# Altium project FD-JUL-MB.PrjPcb (part 2 of 3)

## Sheet Interface.SchDoc
size B; DocumentNumber: 3; SheetNumber: 3; SheetTotal: 7; ENG_APP_DATE: --/--/--; DSN_APP_DATE: --/--/--; CHK_APP_DATE: --/--/--
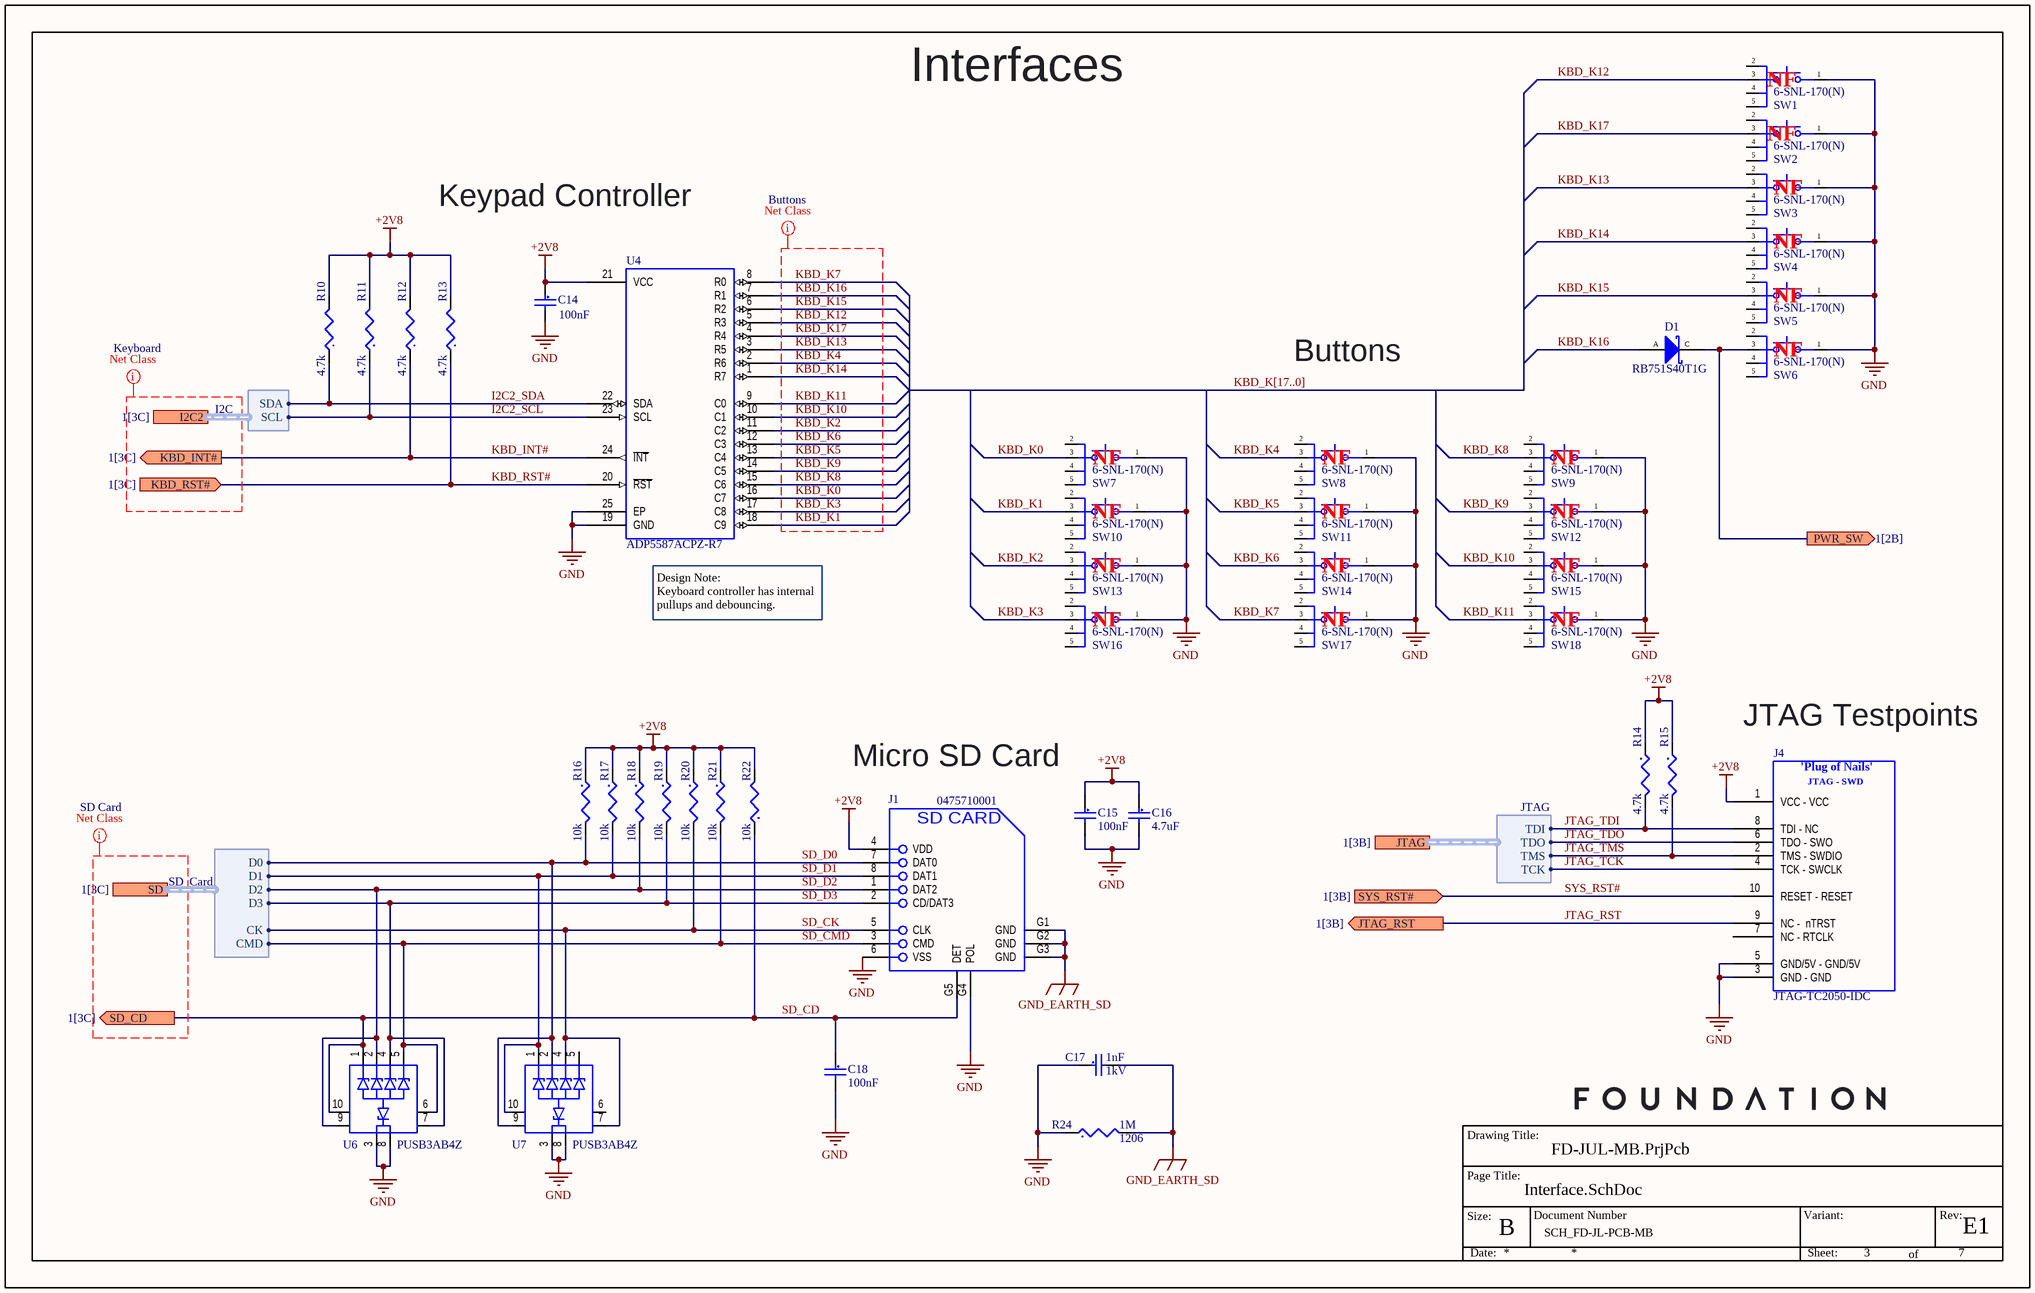
[diagram p3: Interface.SchDoc]

### Parts
C14  Capacitance: 100nF  [CAPC0402(1005)55_L]  (hidden comment: CAP CER 0.1uF 16V 10% X7R 0402)
C15  Capacitance: 100nF  [CAPC0402(1005)55_L]  (hidden comment: CAP CER 0.1uF 16V 10% X7R 0402)
C16  Capacitance: 4.7uF  [CAPC0603(1608)90_L]  (hidden comment: CAP CER 4.7uF 16V 10% X5R 0603)
C17  Capacitance: 1nF  Voltage Rating (DC): 1kV  [CAPC0805(2012)145_N]  (hidden comment: CAP CER 1000pF 1000V 10% X7R 0805)
C18  Capacitance: 100nF  [CAPC0402(1005)55_L]  (hidden comment: CAP CER 0.1uF 16V 10% X7R 0402)
D1  RB751S40T1G  [ON - SOD-523_V]
J1  0475710001  [MOLX - 0475710001_V]
J4  JTAG-TC2050-IDC  [TAGC - TC2050-IDC-FP_V]  (no BOM)
R10  Resistance: 4.7k  [RESC0402(1005)_L]  (hidden comment: RES 4.7K 1/16W 1% 0402)
R11  Resistance: 4.7k  [RESC0402(1005)_L]  (hidden comment: RES 4.7K 1/16W 1% 0402)
R12  Resistance: 4.7k  [RESC0402(1005)_L]  (hidden comment: RES 4.7K 1/16W 1% 0402)
R13  Resistance: 4.7k  [RESC0402(1005)_L]  (hidden comment: RES 4.7K 1/16W 1% 0402)
R14  Resistance: 4.7k  [RESC0402(1005)_L]  (hidden comment: RES 4.7K 1/16W 1% 0402)
R15  Resistance: 4.7k  [RESC0402(1005)_L]  (hidden comment: RES 4.7K 1/16W 1% 0402)
R16  Resistance: 10k  [RESC0402(1005)_L]  (hidden comment: RES 10K 1/16W 1% 0402)
R17  Resistance: 10k  [RESC0402(1005)_L]  (hidden comment: RES 10K 1/16W 1% 0402)
R18  Resistance: 10k  [RESC0402(1005)_L]  (hidden comment: RES 10K 1/16W 1% 0402)
R19  Resistance: 10k  [RESC0402(1005)_L]  (hidden comment: RES 10K 1/16W 1% 0402)
R20  Resistance: 10k  [RESC0402(1005)_L]  (hidden comment: RES 10K 1/16W 1% 0402)
R21  Resistance: 10k  [RESC0402(1005)_L]  (hidden comment: RES 10K 1/16W 1% 0402)
R22  Resistance: 10k  [RESC0402(1005)_L]  (hidden comment: RES 10K 1/16W 1% 0402)
R24  Resistance: 1M  Case Code (Imperial): 1206  [RESC1206(3216)_L]  (hidden comment: RES 1.0M 1/4W 5% 1206)
SW1  6-SNL-170(N)  [TACT - 6-SNL-170_NTP_V]
SW2  6-SNL-170(N)  [TACT - 6-SNL-170_NTP_V]
SW3  6-SNL-170(N)  [TACT - 6-SNL-170_NTP_V]
SW4  6-SNL-170(N)  [TACT - 6-SNL-170_NTP_V]
SW5  6-SNL-170(N)  [TACT - 6-SNL-170_NTP_V]
SW6  6-SNL-170(N)  [TACT - 6-SNL-170_NTP_V]
SW7  6-SNL-170(N)  [TACT - 6-SNL-170_NTP_V]
SW8  6-SNL-170(N)  [TACT - 6-SNL-170_NTP_V]
SW9  6-SNL-170(N)  [TACT - 6-SNL-170_NTP_V]
SW10  6-SNL-170(N)  [TACT - 6-SNL-170_NTP_V]
SW11  6-SNL-170(N)  [TACT - 6-SNL-170_NTP_V]
SW12  6-SNL-170(N)  [TACT - 6-SNL-170_NTP_V]
SW13  6-SNL-170(N)  [TACT - 6-SNL-170_NTP_V]
SW14  6-SNL-170(N)  [TACT - 6-SNL-170_NTP_V]
SW15  6-SNL-170(N)  [TACT - 6-SNL-170_NTP_V]
SW16  6-SNL-170(N)  [TACT - 6-SNL-170_NTP_V]
SW17  6-SNL-170(N)  [TACT - 6-SNL-170_NTP_V]
SW18  6-SNL-170(N)  [TACT - 6-SNL-170_NTP_V]
U4  ADP5587ACPZ-R7  [ADEV - LFCSP-24_L]
U6  PUSB3AB4Z  [NEXP - DFN2510A-10_L]
U7  PUSB3AB4Z  [NEXP - DFN2510A-10_L]

### Ports
I2C2 (harness I2C, see 1[3C]), JTAG (harness JTAG, see 1[3B]), JTAG_RST (out, see 1[3B]), KBD_INT# (out, see 1[3C]), KBD_RST# (in, see 1[3C]), PWR_SW (out, see 1[2B]), SD (harness SD_Card, see 1[3C]), SD_CD (out, see 1[3C]), SYS_RST# (in, see 1[3B])

### Harnesses
SD_Card: CK, CMD, D0, D1, D2, D3
I2C: SCL, SDA
JTAG: TCK, TDI, TDO, TMS

### Nets
+2V8: C14.1 C15.1 C16.1 J1.4(VDD) J4.1(VCC_-_VCC) R10.2 R11.2 R12.2 R13.2 R14.1 R15.1 R16.1 R17.1 R18.1 R19.1 R20.1 R21.1 R22.2 U4.21(VCC)
GND: C14.2 C15.2 C16.2 C17.1 C18.2 J1.6(VSS) J1.G4(POL) J4.3(GND_-_GND) J4.5(GND/5V_-_GND/5V) R24.1 SW1.1 SW2.1 SW3.1 SW4.1 SW5.1 SW6.1 SW7.1 SW8.1 SW9.1 SW10.1 SW11.1 SW12.1 SW13.1 SW14.1 SW15.1 SW16.1 SW17.1 SW18.1 U4.19(GND) U4.25(EP) U6.3(DIODE) U6.8(DIODE) U7.3(DIODE) U7.8(DIODE)
GND_EARTH_SD: C17.2 J1.G1(GND) J1.G2(GND) J1.G3(GND) R24.2
I2C2_SCL: R11.1 U4.23(SCL) ; port I2C2.SCL
I2C2_SDA: R10.1 U4.22(SDA) ; port I2C2.SDA
JTAG_RST: J4.9(NC_-__nTRST) ; port JTAG_RST
JTAG_TCK: J4.4(TCK_-_SWCLK) ; port JTAG.TCK
JTAG_TDI: J4.8(TDI_-_NC) R14.2 ; port JTAG.TDI
JTAG_TDO: J4.6(TDO_-_SWO) ; port JTAG.TDO
JTAG_TMS: J4.2(TMS_-_SWDIO) R15.2 ; port JTAG.TMS
KBD_INT#: R12.1 U4.24(~{INT}) ; port KBD_INT#
KBD_K0: SW7.3 U4.16(C7)
KBD_K1: SW10.3 U4.18(C9)
KBD_K2: SW13.3 U4.11(C2)
KBD_K3: SW16.3 U4.17(C8)
KBD_K4: SW8.3 U4.2(R6)
KBD_K5: SW11.3 U4.13(C4)
KBD_K6: SW14.3 U4.12(C3)
KBD_K7: SW17.3 U4.8(R0)
KBD_K8: SW9.3 U4.15(C6)
KBD_K9: SW12.3 U4.14(C5)
KBD_K10: SW15.3 U4.10(C1)
KBD_K11: SW18.3 U4.9(C0)
KBD_K12: SW1.3 U4.5(R3)
KBD_K13: SW3.3 U4.3(R5)
KBD_K14: SW4.3 U4.1(R7)
KBD_K15: SW5.3 U4.6(R2)
KBD_K16: D1.A U4.7(R1)
KBD_K17: SW2.3 U4.4(R4)
KBD_RST#: R13.1 U4.20(~{RST}) ; port KBD_RST#
PWR_SW: D1.C SW6.3 ; port PWR_SW
SD_CD: C18.1 J1.G5(DET) R22.1 U6.1(DIODE) U6.10(DIODE) ; port SD_CD
SD_CK: J1.5(CLK) R20.2 U7.4(DIODE) U7.7(DIODE) ; port SD.CK
SD_CMD: J1.3(CMD) R21.2 U6.5(DIODE) U6.6(DIODE) ; port SD.CMD
SD_D0: J1.7(DAT0) R16.2 U7.2(A) U7.9(DIODE) ; port SD.D0
SD_D1: J1.8(DAT1) R17.2 U7.1(DIODE) U7.10(DIODE) ; port SD.D1
SD_D2: J1.1(DAT2) R18.2 U6.2(A) U6.9(DIODE) ; port SD.D2
SD_D3: J1.2(CD/DAT3) R19.2 U6.4(DIODE) U6.7(DIODE) ; port SD.D3
SYS_RST#: J4.10(RESET_-_RESET) ; port SYS_RST#

Not connected (* = marked no-connect by the designer): J4 7(NC_-_RTCLK); SW1 2 4 5; SW2 2 4 5; SW3 2 4 5; SW4 2 4 5; SW5 2 4 5; SW6 2 4 5; SW7 2 4 5; SW8 2 4 5; SW9 2 4 5; SW10 2 4 5; SW11 2 4 5; SW12 2 4 5; SW13 2 4 5; SW14 2 4 5; SW15 2 4 5; SW16 2 4 5; SW17 2 4 5; SW18 2 4 5; U7 5(DIODE) 6(DIODE)

### Buses and harness runs
bus KBD_K[17..0]

### Layout directives
net class Keyboard: (no net found under the mark)
net class SD Card: (no net found under the mark)
net class Buttons: KBD_K0, KBD_K1, KBD_K2, KBD_K3, KBD_K4, KBD_K5, KBD_K6, KBD_K7, KBD_K8, KBD_K9, KBD_K10, KBD_K11, KBD_K12, KBD_K13, KBD_K14, KBD_K15, KBD_K16, KBD_K17

### Notes on the sheet
- Interfaces
- Keypad Controller
- Buttons
- (near U4) Design Note:
  Keyboard controller has internal pullups and debouncing.
- (near C15) Micro SD Card
- JTAG Testpoints
- Drawing Title:
- Page Title:
- Size:
- B
- Document Number
- Variant:
- Rev:
- Date:
- Sheet:
- of
- (in symbol CMP-CON-0006-11) 'Plug of Nails'; JTAG - SWD
- (in symbol CMP-CON-0008-2) SD CARD

### Library data of the parts
C14 C15 C18 = CMP-CAP-00002-2: 0.1µF ±10% 16V Ceramic Capacitor X7R 0402 (1005 Metric); Insulation Resistance: 10GR; Material: Ceramic; Tolerance: 10%; REACH SVHC: No SVHC; Radiation Hardening: No; Case Code (Metric): 1005; Height: 0.5mm; Depth: 0.5mm; Min Operating Temperature: -55°C; Max Operating Temperature: 125°C; Lead Free: Lead Free; Thickness: 0.022inch; Length: 1mm; Voltage Rating (DC): 16V; Dielectric Material: Ceramic; Packaging: Tape and Reel; Case/Package: 0402; Width: 0.5mm; Termination: SMD/SMT; Voltage Rating: 16V; Mount: Surface Mount; Case Code (Imperial): 0402; Package Quantity: 1; Dielectric: X7R; Number of Pins: 2; Voltage: 16V
C16 = CMP-CAP-00003-1: 4.7µF ±10% 16V Ceramic Capacitor X5R 0603 (1608 Metric); Length: 1.6mm; Termination: SMD/SMT; Max Operating Temperature: 85°C; Case Code (Imperial): 0603; Height: 0.8mm; Voltage Rating: 16V; Composition: Ceramic; Dielectric: X5R; Voltage Rating (DC): 16V; REACH SVHC: No SVHC; Case Code (Metric): 1608; Tolerance: 10%; Case/Package: 0603; Min Operating Temperature: -55°C; Width: 0.8mm; Mount: Surface Mount; Packaging: Tape and Reel; Package Quantity: 1; Thickness: 0.035inch; Number of Pins: 2
C17 = CMP-CAP-00004-1: 1000pF ±10% 1000V (1kV) Ceramic Capacitor X7R 0805 (2012 Metric); Insulation Resistance: 100GR; Mount: Surface Mount; Width: 1.25mm; Voltage Rating: 1kV; Number of Pins: 2; Packaging: Tape and Reel; Package Quantity: 4000; Termination: SMD/SMT; Height: 1.3mm; Case Code (Metric): 2012; Depth: 1.25mm; Dielectric: X7R; Thickness: 0.051inch; Length: 2.01mm; Case Code (Imperial): 0805; Contact Plating: Nickel,Tin,Matte; Dissipation Factor: 10%; Tolerance: 10%; Case/Package: 0805; Min Operating Temperature: -55°C; REACH SVHC: No SVHC; Lead Free: Lead Free; Dielectric Material: Ceramic; Max Operating Temperature: 125°C
D1 = CMP-DIO-0007-1: Diode Schottky 30V 30mA (DC) Surface Mount SOD-523; Voltage Rating (DC): 40V; Peak Non-Repetitive Surge Current: 500mA; Peak Reverse Current: 500nA; Element Configuration: Single; Capacitance: 2.5pF; Power Dissipation: 200mW; Polarity: Standard; Forward Voltage: 370mV; Radiation Hardening: No; Min Operating Temperature: -55°C; Current Rating: 30mA; Forward Current: 30mA; Number of Pins: 2; Average Rectified Current: 30mA; Output Current: 30mA; Max Operating Temperature: 150°C; Width: 0.9mm; ComponentLink1Description: Datasheet; Length: 1.3mm; Max Surge Current: 500mA; Max Reverse Voltage (DC): 30V; REACH SVHC: No SVHC; Lead Free: Lead Free; Max Reverse Leakage Current: 500nA; Max Forward Surge Current (Ifsm): 500mA; Package Quantity: 1; ComponentLink1URL: https://www.onsemi.cn/PowerSolutions/document/RB751S40T1-D.PDF; Max Repetitive Reverse Voltage (Vrrm): 40V; Contact Plating: Tin,Matte; Case/Package: SOD-523-2; Height: 0.7mm; Packaging: Tape and Reel
J1 = CMP-CON-0008-2: CONN MICRO SD CARD PUSH-PULL R/A; Connector Type: Connector; Number of Contacts: 8; Pitch: 1.1mm; ComponentLink1Description: Drawing; Packaging: Tape and Reel; ComponentLink3Description: Spec; Depth: 5.45mm; Max Operating Temperature: 85°C; Termination: Solder; Housing Material: Polymer; ComponentLink2Description: Electrical Model; Contact Material: Bronze; ComponentLink1URL: https://www.molex.com/pdm_docs/sd/475710001_sd.pdf; Orientation: Right Angle; Min Operating Temperature: -40°C; Mount: Surface Mount; ComponentLink3URL: https://www.molex.com/pdm_docs/ps/PS-47309-001.pdf; ComponentLink2URL: https://media.digikey.com/pdf/Data%20Sheets/Molex%20PDFs/0475710001_Elect_Model.pdf; Contact Plating: Gold; Package Quantity: 1500; Length: 11.4mm; Number of Rows: 1
J4 = CMP-CON-0006-11: PLUG-OF-NAILS 10-PIN W/LEGS; ComponentLink3Description: Cable; ComponentLink2Description: Adapter; ComponentLink1Description: Datasheet; ComponentLink2URL: https://www.tag-connect.com/wp-content/uploads/bsk-pdf-manager/TC2050-ARM2010_18.pdf; ComponentLink3URL: https://www.digikey.com/product-detail/en/tag-connect-llc/TC2050-IDC/TC2050-IDC-ND/2605366; Case/Package: Custom; ComponentLink1URL: https://www.tag-connect.com/wp-content/uploads/bsk-pdf-manager/TC2050-IDC_Datasheet_7.pdf
R10-R15 = CMP-RES-00002-3: 4.7 kOhms ±1% 0.063W, 1/16W Chip Resistor 0402 (1005 Metric) Automotive AEC-Q200 Thick Film; Max Power Dissipation: 63mW; Voltage Rating (DC): 50V; Temperature Coefficient: 100ppm/°C; Weight: 2.3E-05oz; Package Quantity: 10; Military Standard: Not; Contact Plating: Tin; Termination: SMD/SMT; Max Operating Temperature: 155°C; Case Code (Metric): 1005; Case Code (Imperial): 0402; Features: Automotive AEC-Q200; Power Rating: 63mW; REACH SVHC: Unknown; Min Operating Temperature: -55°C; Tolerance: 1%; Mount: Surface Mount; Width: 0.5mm; Depth: 0.5mm; Radiation Hardening: No; Length: 1mm; Number of Terminations: 2; Case/Package: 0402; Voltage Rating: 50V; Height: 0.35mm; Packaging: Tape and Reel; Lead Free: Lead Free; Composition: Thick Film
R16-R21 = CMP-RES-00006-3: 10 kOhms ±1% 0.063W, 1/16W Chip Resistor 0402 (1005 Metric); Voltage Rating (DC): 50V; Power Rating: 63mW; Temperature Coefficient: 100ppm/°C; Case Code (Imperial): 0402; Mount: Surface Mount; Composition: Thick Film; Features: Automotive AEC-Q200; Depth: 0.5mm; Height: 0.35mm; Weight: 2.3E-05oz; Number of Pins: 2; Termination: SMD/SMT; Min Operating Temperature: -55°C; Length: 1mm; Package Quantity: 10; Lead Free: Lead Free; Radiation Hardening: No; Max Operating Temperature: 155°C; Voltage Rating: 50V; Military Standard: Not; Case/Package: 0402; Contact Plating: Tin; Max Power Dissipation: 63mW; Tolerance: 1%; Case Code (Metric): 1005; Number of Terminations: 2; Packaging: Tape and Reel; REACH SVHC: Unknown; Width: 0.02inch
R22 = CMP-RES-00006-3: 10 kOhms ±1% 0.063W, 1/16W Chip Resistor 0402 (1005 Metric); Max Power Dissipation: 63mW; Voltage Rating (DC): 50V; Temperature Coefficient: 100ppm/°C; Width: 0.02inch; Power Rating: 63mW; Case/Package: 0402; Min Operating Temperature: -55°C; Number of Terminations: 2; Lead Free: Lead Free; Features: Automotive AEC-Q200; Number of Pins: 2; Tolerance: 1%; Height: 0.35mm; Mount: Surface Mount; Radiation Hardening: No; Length: 1mm; Case Code (Metric): 1005; Weight: 2.3E-05oz; Military Standard: Not; Depth: 0.5mm; Package Quantity: 10; Max Operating Temperature: 155°C; Termination: SMD/SMT; Case Code (Imperial): 0402; Contact Plating: Tin; Voltage Rating: 50V; Composition: Thick Film; Packaging: Tape and Reel; REACH SVHC: Unknown
R24 = CMP-RES-00004-3: 1 MOhms ±5% 0.25W, 1/4W Chip Resistor 1206 (3216 Metric) Moisture Resistant Thick Film; Power Rating: 250mW; Temperature Coefficient: 200ppm/°C; Voltage Rating: 200V; Mount: Surface Mount; Radiation Hardening: No; Tolerance: 5%; Military Standard: Not; Termination: SMD/SMT; Case Code (Metric): 3216; Depth: 1.6mm; Case/Package: 1206; REACH SVHC: No SVHC; Height: 0.6mm; Max Operating Temperature: 155°C; Package Quantity: 5000; Thickness: 610um; Min Operating Temperature: -55°C; Voltage Rating (DC): 200V; Length: 3.2mm; Composition: Thick Film; Width: 1.6mm; Packaging: Tape and Reel; Contact Plating: Tin
SW1-SW18 = CMP-SWH-00000-9: Tactile Components. 6mm star dome tactile switch.
U4 = CMP-IC-INT-0000-10: I/O Expander 18 I²C 400kHz 24-LFCSP-WQ (4x4); Max Supply Voltage: 3.6V; Number of I/Os: 18; Nominal Supply Current: 200uA; Min Supply Voltage: 1.65V; Interface: I2C; Number of Pins: 24; REACH SVHC: No SVHC; Case/Package: 24-LFCSP-WQ (4x4); Max Operating Temperature: 85°C; Package Quantity: 1500; Min Operating Temperature: -40°C; Frequency: 400kHz; Packaging: Tape and Reel; Mount: Surface Mount; Lead Free: Contains Lead; Max Frequency: 400kHz; ComponentLink1URL: https://www.analog.com/media/en/technical-documentation/data-sheets/ADP5587.pdf; ComponentLink1Description: Datasheet; Max Supply Current: 200uA
U6 U7 = CMP-DIO-0006-4: TVS DIODE 3.3V 5V DFN2510A-10; Capacitance @ Frequency: 0.17pF @ 1MHz; Bidirectional Channels: 4; Type: Zener; Max Operating Temperature: 85°C; Min Operating Temperature: -40°C; Case/Package: DFN2510A-10; ComponentLink1Description: Datasheet; ComponentLink1URL: https://assets.nexperia.com/documents/data-sheet/PUSB3AB4.pdf

## Sheet Power.SchDoc
size B; DocumentNumber: 6; SheetNumber: 6; SheetTotal: 7; ENG_APP_DATE: --/--/--; DSN_APP_DATE: --/--/--; CHK_APP_DATE: --/--/--
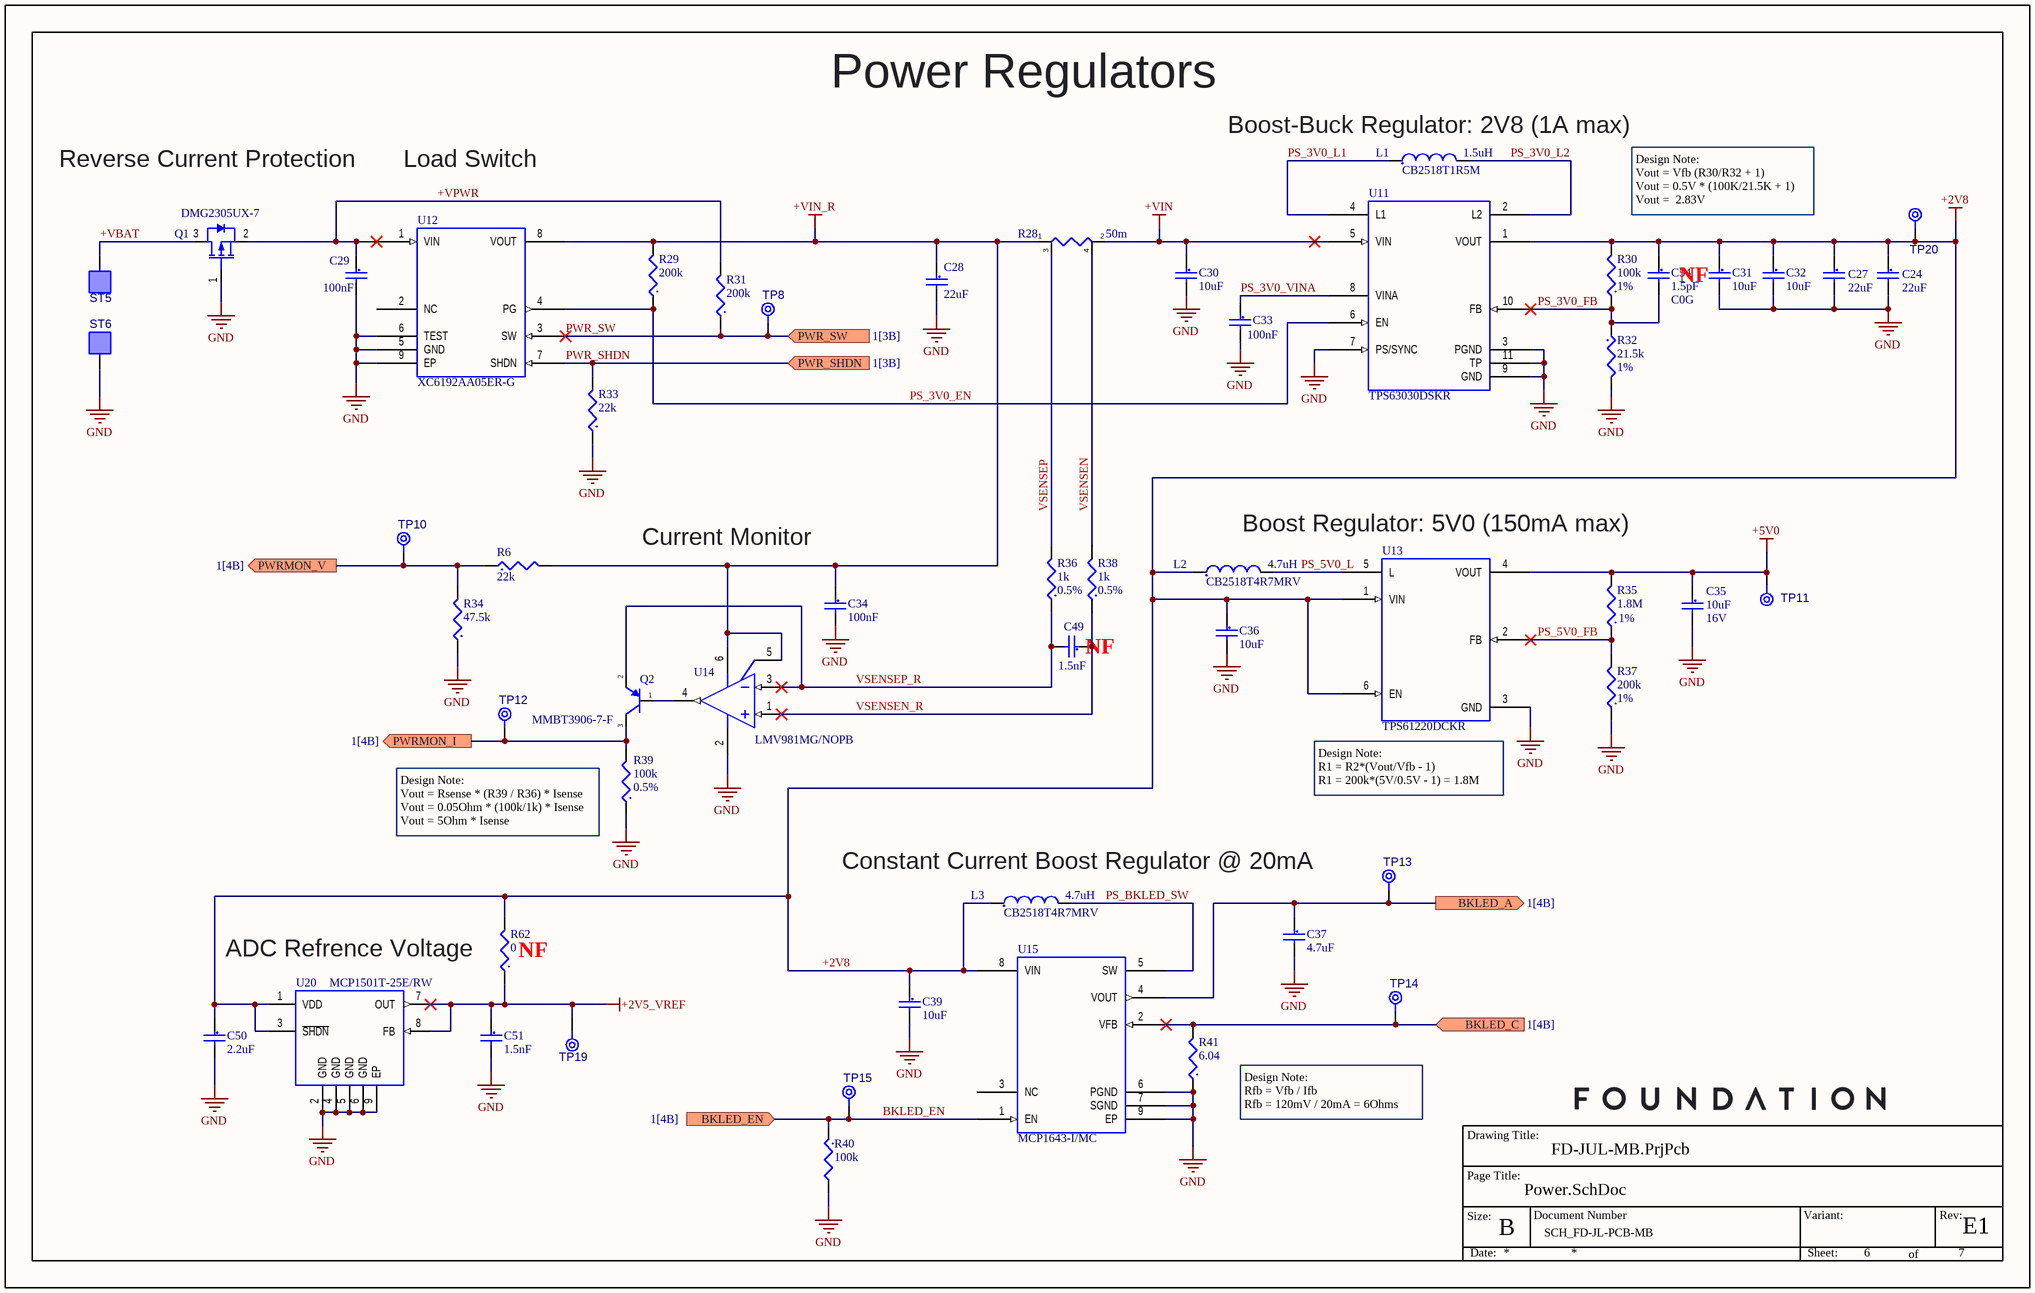
[diagram p4: Power.SchDoc]

### Parts
C24  Capacitance: 22uF  [CAPC0805(2012)145_L]  (hidden comment: CAP CER 22uF 16V 10% X5R 0805)
C27  Capacitance: 22uF  [CAPC0805(2012)145_L]  (hidden comment: CAP CER 22uF 16V 10% X5R 0805)
C28  Capacitance: 22uF  [CAPC0805(2012)145_L]  (hidden comment: CAP CER 22uF 16V 10% X5R 0805)
C29  Capacitance: 100nF  [CAPC0402(1005)55_L]  (hidden comment: CAP CER 0.1uF 16V 10% X7R 0402)
C30  Capacitance: 10uF  [CAPC0603(1608)90_L]  (hidden comment: CAP CER 10uF 6.3V 20% X5R 0603)
C31  Capacitance: 10uF  [CAPC0603(1608)90_L]  (hidden comment: CAP CER 10uF 6.3V 20% X5R 0603)
C32  Capacitance: 10uF  [CAPC0603(1608)90_L]  (hidden comment: CAP CER 10uF 6.3V 20% X5R 0603)
C33  Capacitance: 100nF  [CAPC0402(1005)55_L]  (hidden comment: CAP CER 0.1uF 16V 10% X7R 0402)
C34  Capacitance: 100nF  [CAPC0402(1005)55_L]  (hidden comment: CAP CER 0.1uF 16V 10% X7R 0402)
C35  Capacitance: 10uF  Voltage Rating (DC): 16V  [CAPC0603(1608)90_L]  (hidden comment: CAP CER 10uF 16V 20% X5R 0603)
C36  Capacitance: 10uF  [CAPC0603(1608)90_L]  (hidden comment: CAP CER 10uF 6.3V 20% X5R 0603)
C37  Capacitance: 4.7uF  [CAPC0603(1608)90_L]  (hidden comment: CAP CER 4.7uF 16V 10% X5R 0603)
C39  Capacitance: 10uF  [CAPC0603(1608)90_L]  (hidden comment: CAP CER 10uF 6.3V 20% X5R 0603)
C49  Capacitance: 1.5nF  [CAPC0402(1005)55_L]  (hidden comment: CAP CER 1500pF 50V 10% X7R 0402)
C50  Capacitance: 2.2uF  [CAPC0402(1005)55_L]  (hidden comment: CAP CER 2.2uF 6.3V 10% X5R 0402)
C51  Capacitance: 1.5nF  [CAPC0402(1005)55_L]  (hidden comment: CAP CER 1500pF 50V 10% X7R 0402)
C54  Capacitance: 1.5pF  Dielectric: C0G  [CAPC0402(1005)55_L]  (hidden comment: CAP CER 1.5pF 50V C0G 0402)
L1  CB2518T1R5M  Inductance: 1.5uH  [INDC1007(2518)_L]
L2  CB2518T4R7MRV  Inductance: 4.7uH  [INDC1007(2518)_L]
L3  CB2518T4R7MRV  Inductance: 4.7uH  [INDC1007(2518)_L]
Q1  DMG2305UX-7  [DIOD-SOT23-3_A_V]
Q2  MMBT3906-7-F  [DIOD-SOT23-3_A_V]
R6  Resistance: 22k  [RESC0402(1005)_L]  (hidden comment: RES 22K 1/16W 1% 0402)
R28  Resistance: 50m  [RESC4T1206(3216)_V]  (hidden comment: RES4T 0.05 OHM 0.5% 1/2W 1206)
R29  Resistance: 200k  [RESC0402(1005)_L]  (hidden comment: RES 200K 1/16W 1% 0402)
R30  Resistance: 100k  Tolerance: 1%  [RESC0402(1005)_L]  (hidden comment: RES 100K 1/16W 1% 0402)
R31  Resistance: 200k  [RESC0402(1005)_L]  (hidden comment: RES 200K 1/16W 1% 0402)
R32  Resistance: 21.5k  Tolerance: 1%  [RESC0402(1005)_L]  (hidden comment: RES 21.5K 1/16W 1% 0402)
R33  Resistance: 22k  [RESC0402(1005)_L]  (hidden comment: RES 22K 1/16W 1% 0402)
R34  Resistance: 47.5k  [RESC0402(1005)_L]  (hidden comment: RES 47.5K 1/16W 1% 0402)
R35  Resistance: 1.8M  Tolerance: 1%  [RESC0402(1005)_L]  (hidden comment: RES 1.8M 1/16W 1% 0402)
R36  Resistance: 1k  Tolerance: 0.5%  [RESC0402(1005)_L]  (hidden comment: RES 1.0K 1/16W 1% 0402)
R37  Resistance: 200k  Tolerance: 1%  [RESC0402(1005)_L]  (hidden comment: RES 200K 1/16W 1% 0402)
R38  Resistance: 1k  Tolerance: 0.5%  [RESC0402(1005)_L]  (hidden comment: RES 1.0K 1/16W 1% 0402)
R39  Resistance: 100k  Tolerance: 0.5%  [RESC0402(1005)_L]  (hidden comment: RES 100K 1/16W 0.5% 0402)
R40  Resistance: 100k  [RESC0402(1005)_L]  (hidden comment: RES 100K 1/16W 1% 0402)
R41  Resistance: 6.04  [RESC0402(1005)_L]  (hidden comment: RES 6.04 OHM 1/16W 1% 0402)
R62  Resistance: 0  [RESC0402(1005)_L]  (hidden comment: RES 0 OHM JUMPER 1/16W 0402)
ST5  PAD-2_54X2_54Y  [PAD-2_54X2_54Y]  (value not drawn)  (no BOM)
ST6  PAD-2_54X2_54Y  [PAD-2_54X2_54Y]  (value not drawn)  (no BOM)
TP8  TPAD8R  [TP08R]  (value not drawn)  (no BOM)
TP10  TPAD8R  [TP08R]  (value not drawn)  (no BOM)
TP11  TPAD8R  [TP08R]  (value not drawn)  (no BOM)
TP12  TPAD8R  [TP08R]  (value not drawn)  (no BOM)
TP13  TPAD8R  [TP08R]  (value not drawn)  (no BOM)
TP14  TPAD8R  [TP08R]  (value not drawn)  (no BOM)
TP15  TPAD8R  [TP08R]  (value not drawn)  (no BOM)
TP19  TPAD8R  [TP08R]  (value not drawn)  (no BOM)
TP20  TPAD8R  [TP08R]  (value not drawn)  (no BOM)
U11  TPS63030DSKR  [TI - VSON-10_L]
U12  XC6192AA05ER-G  [TORX - USP-8B06_V]
U13  TPS61220DCKR  [TI - SC70-6_L]
U14  LMV981MG/NOPB  [TI - SC70-6_L]
U15  MCP1643-I/MC  [MCHP - DFN-8_L]
U20  MCP1501T-25E/RW  [MCHP - WDFN-8_L]

### Ports
BKLED_A (out, see 1[4B]), BKLED_C (in, see 1[4B]), BKLED_EN (in, see 1[4B]), PWR_SHDN (in, see 1[3B]), PWR_SW (in, see 1[3B]), PWRMON_I (out, see 1[4B]), PWRMON_V (out, see 1[4B])

### Nets
+2V5_VREF: C51.1 R62.1 TP19.1(TP) U20.7(OUT) U20.8(FB)
+2V8: C24.1 C27.1 C31.1 C32.1 C36.1 C39.1 C50.1 C54.1 L2.1 L3.1 R30.2 R62.2 TP20.1(TP) U11.1(VOUT) U13.1(VIN) U13.6(EN) U15.8(VIN) U20.1(VDD) U20.3(~{SHDN})
+5V0: C35.1 R35.2 TP11.1(TP) U13.4(VOUT)
+VIN: C30.1 R28.2(I2) U11.5(VIN)
+VIN_R: C28.1 C34.1 R6.2 R28.1(I1) R29.2 U12.8(VOUT) U14.5(~{SHDN}) U14.6(VDD)
GND: C24.2 C27.2 C28.2 C29.2 C30.2 C31.2 C32.2 C33.2 C34.2 C35.2 C36.2 C37.2 C39.2 C50.2 C51.2 Q1.1(GATE) R32.2 R33.1 R34.1 R37.1 R39.1 R40.2 R41.1 ST6.1 U11.3(PGND) U11.7(PS/SYNC) U11.9(GND) U11.11(TP) U12.5(GND) U12.6(TEST) U12.9(EP) U13.3(GND) U14.2(GND) U15.6(PGND) U15.7(SGND) U15.9(EP) U20.2(GND) U20.4(GND) U20.5(GND) U20.6(GND) U20.9(EP)
+VBAT: Q1.3(DRAIN) ST5.1
+VPWR: C29.1 Q1.2(SOURCE) R31.2 U12.1(VIN)
BKLED_A: C37.1 TP13.1(TP) U15.4(VOUT) ; port BKLED_A
BKLED_C: R41.2 TP14.1(TP) U15.2(VFB) ; port BKLED_C
BKLED_EN: R40.1 TP15.1(TP) U15.1(EN) ; port BKLED_EN
PS_3V0_EN: R29.1 U11.6(EN) U12.4(PG)
PS_3V0_FB: C54.2 R30.1 R32.1 U11.10(FB)
PS_3V0_L1: L1.1 U11.4(L1)
PS_3V0_L2: L1.2 U11.2(L2)
PS_3V0_VINA: C33.1 U11.8(VINA)
PS_5V0_FB: R35.1 R37.2 U13.2(FB)
PS_5V0_L: L2.2 U13.5(L)
PS_BKLED_SW: L3.2 U15.5(SW)
PWR_SHDN: R33.2 U12.7(SHDN) ; port PWR_SHDN
PWR_SW: R31.1 TP8.1(TP) U12.3(SW) ; port PWR_SW
PWRMON_I: Q2.3(C) R39.2 TP12.1(TP) ; port PWRMON_I
PWRMON_V: R6.1 R34.2 TP10.1(TP) ; port PWRMON_V
VSENSEN: R28.4(E2) R38.2
VSENSEN_R: C49.1 R38.1 U14.1(IN+)
VSENSEP: R28.3(E1) R36.2
VSENSEP_R: C49.2 Q2.2(E) R36.1 U14.3(IN-)
NetQ2_1: Q2.1(B) U14.4(OUT)

Not connected (* = marked no-connect by the designer): U12 2(NC); U15 3(NC)

### Notes on the sheet
- Power Regulators
- (near L1) Boost-Buck Regulator: 2V8 (1A max)
- Reverse Current Protection
- Load Switch
- Design Note:
  Vout = Vfb (R30/R32 + 1)
  Vout = 0.5V * (100K/21.5K + 1)
  Vout =  2.83V
- (near C34) Current Monitor
- Boost Regulator: 5V0 (150mA max)
- Design Note:
  Vout = Rsense * (R39 / R36) * Isense
  Vout = 0.05Ohm * (100k/1k) * Isense
  Vout = 5Ohm * Isense
- (near U13) Design Note:
  R1 = R2*(Vout/Vfb - 1)
  R1 = 200k*(5V/0.5V - 1) = 1.8M
- (near L3) Constant Current Boost Regulator @ 20mA
- ADC Refrence Voltage
- Design Note:
  Rfb = Vfb / Ifb
  Rfb = 120mV / 20mA = 6Ohms
- Drawing Title:
- Page Title:
- Size:
- B
- Document Number
- Variant:
- Rev:
- Date:
- Sheet:
- of

### Library data of the parts
C24 C27 C28 = CMP-CAP-00010-2: 22µF ±10% 16V Ceramic Capacitor X5R 0805 (2012 Metric); Packaging: Tape and Reel; Length: 2mm; Max Operating Temperature: 85°C; REACH SVHC: No SVHC; Lead Free: Lead Free; Termination: SMD/SMT; Width: 0.049inch; Thickness: 0.057inch; Min Operating Temperature: -55°C; Height: 1.25mm; Tolerance: 10%; Case/Package: 0805; Dielectric: X5R; Voltage: 16V; Mount: Surface Mount; Case Code (Imperial): 0805; Dielectric Material: Ceramic; Voltage Rating: 16V; Voltage Rating (DC): 16V; Depth: 1.25mm; Case Code (Metric): 2012; Package Quantity: 1; Weight: 0.000194oz; Number of Pins: 2; Composition: Ceramic
C29 C33 C34 = CMP-CAP-00002-2: as C14 on sheet Interface; Material: Ceramic; Tolerance: 10%; REACH SVHC: No SVHC; Radiation Hardening: No; Case Code (Metric): 1005; Height: 0.5mm; Depth: 0.5mm; Min Operating Temperature: -55°C; Max Operating Temperature: 125°C; Lead Free: Lead Free; Thickness: 0.022inch; Length: 1mm; Voltage Rating (DC): 16V; Dielectric Material: Ceramic; Packaging: Tape and Reel; Case/Package: 0402; Width: 0.5mm; Termination: SMD/SMT; Voltage Rating: 16V; Mount: Surface Mount; Case Code (Imperial): 0402; Package Quantity: 1; Dielectric: X7R; Number of Pins: 2; Voltage: 16V
C30-C32 C36 C39 = CMP-CAP-00044-1: 10µF ±20% 6.3V Ceramic Capacitor X5R 0603 (1608 Metric); Max Operating Temperature: 85°C; Packaging: Tape and Reel; Case Code (Metric): 1608; Radiation Hardening: No; REACH SVHC: No SVHC; Min Operating Temperature: -55°C; Tolerance: 20%; Lead Free: Lead Free; Thickness: 0.035inch; Voltage Rating (DC): 6.3V; Material: Ceramic; Width: 0.031inch; Length: 1.6mm; Voltage: 6.3V; Mount: Surface Mount; Voltage Rating: 6.3V; Termination: SMD/SMT; Depth: 0.8mm; Dielectric: X5R; Case/Package: 0603; Package Quantity: 4000; Case Code (Imperial): 0603; Height: 0.8mm
C35 = CMP-CAP-00036-1: 10µF ±20% 16V Ceramic Capacitor X5R 0603 (1608 Metric); Termination: SMD/SMT; Mount: Surface Mount; Halogen Free: Halogen Free; Packaging: Tape and Reel; Width: 0.031inch; Length: 0.063inch; Voltage Rating: 16V; Thickness: 0.031inch; Package Quantity: 1; REACH SVHC: Unknown; Max Operating Temperature: 85°C; Min Operating Temperature: -55°C; Case Code (Imperial): 0603; Dielectric: X5R; Height: 0.8mm; Case/Package: 0603; Tolerance: 20%; Case Code (Metric): 1608
C37 = CMP-CAP-00003-1: as C16 on sheet Interface; Max Operating Temperature: 85°C; Packaging: Tape and Reel; Case Code (Metric): 1608; REACH SVHC: No SVHC; Min Operating Temperature: -55°C; Tolerance: 10%; Thickness: 0.035inch; Voltage Rating (DC): 16V; Width: 0.8mm; Length: 1.6mm; Mount: Surface Mount; Voltage Rating: 16V; Termination: SMD/SMT; Dielectric: X5R; Case/Package: 0603; Package Quantity: 1; Case Code (Imperial): 0603; Height: 0.8mm; Composition: Ceramic; Number of Pins: 2
C49 C51 = CMP-CAP-00034-1: 1500pF ±10% 50V Ceramic Capacitor X7R 0402 (1005 Metric); Material: Ceramic; Tolerance: 10%; Radiation Hardening: No; Case Code (Metric): 1005; Height: 0.5mm; Depth: 0.5mm; Min Operating Temperature: -55°C; Max Operating Temperature: 125°C; Thickness: 0.022inch; Length: 1mm; Packaging: Tape and Reel; Case/Package: 0402; Width: 0.02inch; Voltage Rating: 50V; Mount: Surface Mount; Case Code (Imperial): 0402; Package Quantity: 1; Dielectric: X7R; Voltage: 50V; Contact Plating: Tin
C50 = CMP-CAP-00042-1: 2.2µF ±10% 6.3V Ceramic Capacitor X5R 0402 (1005 Metric); Lead Free: Lead Free; Tolerance: 10%; Width: 0.02inch; Number of Pins: 2; Contact Plating: Tin,Matte; Max Operating Temperature: 85°C; Termination: SMD/SMT; Voltage Rating: 6.3V; Thickness: 0.022inch; Case Code (Imperial): 0402; Case Code (Metric): 1005; Radiation Hardening: No; Package Quantity: 1; Mount: Surface Mount; Length: 1mm; Case/Package: 0402; REACH SVHC: No SVHC; Packaging: Tape and Reel; Min Operating Temperature: -55°C; Dielectric: X5R; Depth: 0.5mm; Voltage Rating (DC): 6.3V
C54 = CMP-CAP-00048-1: 1.5pF ±0.25pF 50V Ceramic Capacitor C0G, NP0 0402 (1005 Metric); Tolerance: 20%; Mount: Surface Mount; Min Operating Temperature: -55°C; Lead Free: Lead Free; Termination: SMD/SMT; Width: 0.02inch; Voltage: 50V; Height: 0.5mm; Package Quantity: 1; Voltage Rating (DC): 50V; Packaging: Tape and Reel; Max Operating Temperature: 125°C; Case Code (Imperial): 0402; Voltage Rating: 50V; Case/Package: 0402; Case Code (Metric): 1005; Thickness: 0.022inch; Length: 1mm; Radiation Hardening: No; Depth: 0.5mm
L1 = CMP-IND-0004-1: 1.5µH Unshielded Wirewound Inductor 1.4A 91mOhm Max 1007 (2518 Metric); Test Frequency: 7.96MHz; Saturation Current: 650mA; Tolerance: 20%; Self Resonant Frequency: 80MHz; DC Resistance (DCR): 91mR; Core Material: Ferrite; Termination: SMD/SMT; Shielding: Unshielded; Min Operating Temperature: -40°C; Current Rating: 1.4A; Max Operating Temperature: 105°C; Width: 1.8mm; Case/Package: 1007; Mount: Surface Mount; Height: 1.8mm; Height - Seated (Max): 0.079inch; Packaging: Tape and Reel; Length: 0.098inch; Composition: Wirewound; Package Quantity: 2000; Max DC Current: 650mA; ComponentLink1Description: Datasheet; ComponentLink1URL: https://www.yuden.co.jp/productdata/catalog/wound02_e.pdf; Radiation Hardening: No; Depth: 2mm; Lead Free: Lead Free; Case Code (Imperial): 1007; Halogen Free: Halogen Free; Case Code (Metric): 2518
L2 L3 = CMP-IND-0006-1: 4.7µH Unshielded Wirewound Inductor 820mA 130mOhm Max 1007 (2518 Metric); Max DC Current: 310mA; Tolerance: 20%; Test Frequency: 7.96MHz; DC Resistance (DCR): 130mR; Self Resonant Frequency: 46MHz; Resistance: 0.1R; Shielding: Unshielded; Height: 1.8mm; Packaging: Tape and Reel; Depth: 1.8mm; Mount: Surface Mount; Composition: Wirewound; Min Operating Temperature: -40°C; Current Rating: 820mA; Width: 0.071inch; Length: 0.098inch; Case/Package: 1007; Height - Seated (Max): 0.079inch; Termination: SMD/SMT; Package Quantity: 2000; Saturation Current: 310mA; Lead Free: Lead Free; Max Operating Temperature: 105°C; Case Code (Metric): 2518; Radiation Hardening: No; Case Code (Imperial): 1007
Q1 = CMP-TRNST-0000-3: P-Channel 20V 4.2A (Ta) 1.4W (Ta) Surface Mount SOT-23; Turn-Off Delay Time: 79.3ns; Fall Time: 34.7ns; On-State Resistance: 52MR; Vgs(th) (Max) @ Id: 900mV @ 250µA; Gate to Source Voltage (Vgs): 8V; Number of Channels: 1; Input Capacitance: 808pF; Element Configuration: Single; Threshold Voltage: -900mV; Drain to Source Resistance: 200mR; Rise Time: 13.7ns; Turn-On Delay Time: 10.8ns; ComponentLink1Description: Datasheet; Mount: Surface Mount; Max Operating Temperature: 150°C; Packaging: Tape and Reel; Continuous Drain Current (ID): 4.2A; REACH SVHC: No SVHC; Drain to Source Voltage (Vdss): 20V; RoHS Compliant: Yes; Height: 1.1mm; ComponentLink1URL: https://www.diodes.com/assets/Datasheets/DMG2305UX.pdf; Contact Plating: Tin,Matte; Weight: 0.000282oz; Package Quantity: 3000; Lead Free: Lead Free; Vgs (Max): 8V; Transistor Type: P-Channel; Rds On Max: 52mR; Width: 1.4mm; Number of Pins: 3; Max Power Dissipation: 1.4W; Case/Package: SOT-23; Min Operating Temperature: -55°C; Length: 3mm; Radiation Hardening: No
Q2 = CMP-TRNST-0001-1: TRANS PNP 40V 0.2A SOT23-3; Max Frequency: 250MHz; Continuous Collector Current: -200mA; Voltage Rating (DC): -40V; Element Configuration: Single; Number of Elements: 1; hFE Min: 100; Collector Emitter Saturation Voltage: -400mV; Power Dissipation: 300mW; Emitter Base Voltage (VEBO): 6V; Max Collector Current: 200mA; Max Operating Temperature: 150°C; Mount: Surface Mount; Packaging: Tape and Reel; Current Rating: -200mA; Gain Bandwidth Product: 250MHz; Case/Package: SOT-23; Collector Emitter Voltage (VCEO): 40V; Contact Plating: Tin,Matte; Transition Frequency: 250MHz; Collector Emitter Breakdown Voltage: 40V; ComponentLink1Description: Datasheet; Lead Free: Lead Free; Radiation Hardening: No; Collector Base Voltage (VCBO): 40V; Number of Pins: 3; ComponentLink1URL: https://media.digikey.com/pdf/Data%20Sheets/Diodes%20PDFs/MMBT3906.pdf; Frequency: 250MHz; Max Power Dissipation: 300mW; Package Quantity: 3000; Height: 1mm; Width: 1.4mm; Min Operating Temperature: -55°C; REACH SVHC: No SVHC; Length: 3.05mm; Polarity: PNP; Max Breakdown Voltage: 40V; Weight: 0.000282oz
R6 = CMP-RES-00040-1: 22 kOhms ±1% 0.063W, 1/16W Chip Resistor 0402 (1005 Metric); Temperature Coefficient: 100ppm/°C; Voltage Rating (DC): 50V; Power Rating: 63mW; Case/Package: 0402; Package Quantity: 10; Lead Free: Lead Free; Composition: Thick Film; Height: 0.35mm; Length: 1mm; Radiation Hardening: No; Width: 0.5mm; Max Operating Temperature: 155°C; Depth: 0.5mm; REACH SVHC: Unknown; Min Operating Temperature: -55°C; Case Code (Metric): 1005; Working Voltage: 50V; Mount: Surface Mount; Contact Plating: Tin; Number of Terminations: 2; Weight: 2.3E-05oz; Packaging: Tape and Reel; Termination: SMD/SMT; Tolerance: 1%; Case Code (Imperial): 0402; Military Standard: Not; Voltage Rating: 50V; Max Power Dissipation: 63mW; Features: Automotive AEC-Q200
R28 = CMP-RES-00044-2: 50 mOhms ±0.5% 0.5W, 1/2W Chip Resistor 1206 (3216 Metric) Current Sense; Temperature Coefficient: 35ppm/°C; Tolerance: 1%; Voltage Rating: 160mV; Max Power Dissipation: 500mW; Features: Moisture Resistant; Number of Terminations: 4; Length: 0.126inch; Case Code (Imperial): 1206; Lead Free: Lead Free; Composition: Metal Element; Max Operating Temperature: 170°C; Height: 0.035inch; Case/Package: 1206; Min Operating Temperature: -65°C; Case Code (Metric): 3216; Width: 0.063inch; Packaging: Tape and Reel
R29 R31 R37 = CMP-RES-00007-3: 200 kOhms ±1% 0.063W, 1/16W Chip Resistor 0402 (1005 Metric) Moisture Resistant Thick Film; Working Voltage: 50V; Temperature Coefficient: 100ppm/°C; Max Power Dissipation: 63mW; Power Rating: 62.5mW; Min Operating Temperature: -55°C; Depth: 0.5mm; Height: 0.016inch; Length: 1mm; Number of Terminations: 2; Termination: SMD/SMT; Composition: Thick Film; Military Standard: Not; Case Code (Metric): 1005; Case Code (Imperial): 0402; REACH SVHC: No SVHC; Voltage Rating (DC): 50V; Features: Moisture Resistant; Packaging: Tape and Reel; Width: 0.02inch; Lead Free: Lead Free; Package Quantity: 1; Voltage Rating: 50V; Case/Package: 0402; Max Operating Temperature: 155°C
  R29 R31: Tolerance: 1%
R30 = CMP-RES-00003-3: 100 kOhms ±1% 0.063W, 1/16W Chip Resistor 0402 (1005 Metric) Automotive AEC-Q200 Thick Film; Temperature Coefficient: 100ppm/°C; Max Power Dissipation: 63mW; Voltage Rating: 50V; Width: 0.02inch; Number of Terminations: 2; Composition: Thick Film; Radiation Hardening: No; Case Code (Imperial): 0402; Depth: 0.5mm; Packaging: Tape and Reel; Length: 1mm; Min Operating Temperature: -55°C; Contact Plating: Tin; Features: Automotive AEC-Q200; Max Operating Temperature: 155°C; Power Rating: 63mW; Mount: Surface Mount; Case Code (Metric): 1005; Case/Package: 0402; Height: 0.35mm; Lead Free: Lead Free; Military Standard: Not; Termination: SMD/SMT; Package Quantity: 10000; Voltage Rating (DC): 50V; REACH SVHC: Unknown; Number of Pins: 2; Weight: 2.3E-05oz
R32 = CMP-RES-00073-1: 21.5 kOhms ±1% 0.063W, 1/16W Chip Resistor 0402 (1005 Metric); Reference Standard: AEC-Q200; Package Height: 0.35mm; Rated Power Dissipation (P): 63mW; Rated Temperature: 70°C; Package Width: 0.5mm; Voltage Rating: 50V; Temperature Coefficient: 100ppm/°C; Number of Terminals/Pins: 2; Package Length: 1mm; Mount: Surface Mount; Resistor Type: FIXED RESISTOR; Max Operating Temperature: 155°C; JESD-609 Code: e3; Package Shape: Rectangular; Terminal Finish: Nickel; Packaging: Tape and Reel; Size Code: 0402; Package Style: SMTMeter; Technology: METAL GLAZE/THICK FILM; Termination: Wraparound; Working Voltage: 50V; Construction: Chip; Min Operating Temperature: -55°C
R33 = CMP-RES-00040-1: 22 kOhms ±1% 0.063W, 1/16W Chip Resistor 0402 (1005 Metric); Max Power Dissipation: 63mW; Voltage Rating: 50V; Temperature Coefficient: 100ppm/°C; Military Standard: Not; Lead Free: Lead Free; Max Operating Temperature: 155°C; Termination: SMD/SMT; REACH SVHC: Unknown; Packaging: Tape and Reel; Composition: Thick Film; Weight: 2.3E-05oz; Mount: Surface Mount; Height: 0.35mm; Length: 1mm; Min Operating Temperature: -55°C; Radiation Hardening: No; Voltage Rating (DC): 50V; Number of Terminations: 2; Features: Automotive AEC-Q200; Package Quantity: 10; Depth: 0.5mm; Working Voltage: 50V; Case/Package: 0402; Case Code (Metric): 1005; Case Code (Imperial): 0402; Tolerance: 1%; Power Rating: 63mW; Width: 0.5mm; Contact Plating: Tin
R34 = CMP-RES-00048-1: 47.5 kOhms ±1% 0.063W, 1/16W Chip Resistor 0402 (1005 Metric); Temperature Coefficient: 100ppm/°C; Power Rating: 63mW; Voltage Rating (DC): 50V; Number of Pins: 2; REACH SVHC: Unknown; Weight: 2.3E-05oz; Height: 0.35mm; Number of Terminations: 2; Case Code (Imperial): 0402; Case/Package: 0402; Features: Automotive AEC-Q200; Max Operating Temperature: 155°C; Case Code (Metric): 1005; Packaging: Tape and Reel; Length: 1mm; Min Operating Temperature: -55°C; Voltage Rating: 50V; Max Power Dissipation: 63mW; Package Quantity: 10; Mount: Surface Mount; Contact Plating: Tin; Tolerance: 1%; Width: 0.02inch; Lead Free: Lead Free; Composition: Thick Film; Radiation Hardening: No; Military Standard: Not; Termination: SMD/SMT; Depth: 0.5mm
R35 = CMP-RES-00016-4: 1.8 MOhms ±1% 0.063W, 1/16W Chip Resistor 0402 (1005 Metric); Voltage Rating: 50V; Power Rating: 63mW; Temperature Coefficient: 100ppm/°C; Height: 0.35mm; Composition: Thick Film; Case/Package: 0402; Contact Plating: Tin; Number of Pins: 2; REACH SVHC: Unknown; Lead Free: Lead Free; Radiation Hardening: No; Length: 1mm; Min Operating Temperature: -55°C; Max Operating Temperature: 155°C; Military Standard: Not; Mount: Surface Mount; Termination: SMD/SMT; Weight: 2.3E-05oz; Packaging: Tape and Reel; Depth: 0.5mm; Package Quantity: 10000; Case Code (Metric): 1005; Width: 0.5mm; Case Code (Imperial): 0402; Voltage Rating (DC): 50V
R36 R38 = CMP-RES-00000-3: 1 kOhms ±0.5% 0.063W, 1/16W Chip Resistor 0402 (1005 Metric) Automotive AEC-Q200 Thin Film; Voltage Rating: 25V; Power Rating: 62.5mW; Temperature Coefficient: 25ppm/°C; Max Power Dissipation: 63mW; Min Operating Temperature: -55°C; Radiation Hardening: No; Mount: Surface Mount; Height: 0.016inch; Military Standard: Not; Lead Free: Lead Free; Depth: 0.5mm; Package Quantity: 10000; Max Operating Temperature: 155°C; Weight: 2.8E-05oz; Case Code (Imperial): 0402; Number of Terminations: 2; Case Code (Metric): 1005; Termination: SMD/SMT; Packaging: Tape and Reel; Case/Package: 0402; Voltage Rating (DC): 25V; REACH SVHC: No SVHC; Width: 0.5mm; Length: 1mm; Contact Plating: Tin; Composition: Metal Film,Thin Film
R39 = CMP-RES-00046-1: 100 kOhms ±0.5% 0.063W, 1/16W Chip Resistor 0402 (1005 Metric); Temperature Coefficient: 25ppm/°C; Voltage Rating (DC): 25V; Max Power Dissipation: 63mW; Width: 0.5mm; REACH SVHC: No SVHC; Military Standard: Not; Contact Plating: Tin; Radiation Hardening: No; Min Operating Temperature: -55°C; Depth: 0.5mm; Composition: Metal Film,Thin Film; Case Code (Imperial): 0402; Termination: SMD/SMT; Number of Terminations: 2; Lead Free: Lead Free; Case Code (Metric): 1005; Mount: Surface Mount; Package Quantity: 10000; Voltage Rating: 25V; Max Operating Temperature: 155°C; Case/Package: 0402; Packaging: Tape and Reel; Power Rating: 63mW; Height: 0.016inch; Length: 1mm
R40 = CMP-RES-00003-3: 100 kOhms ±1% 0.063W, 1/16W Chip Resistor 0402 (1005 Metric) Automotive AEC-Q200 Thick Film; Max Power Dissipation: 63mW; Voltage Rating: 50V; Temperature Coefficient: 100ppm/°C; Max Operating Temperature: 155°C; Weight: 2.3E-05oz; Packaging: Tape and Reel; REACH SVHC: Unknown; Length: 1mm; Features: Automotive AEC-Q200; Depth: 0.5mm; Composition: Thick Film; Case Code (Imperial): 0402; Number of Terminations: 2; Package Quantity: 10000; Min Operating Temperature: -55°C; Number of Pins: 2; Lead Free: Lead Free; Military Standard: Not; Case/Package: 0402; Contact Plating: Tin; Tolerance: 1%; Radiation Hardening: No; Termination: SMD/SMT; Voltage Rating (DC): 50V; Mount: Surface Mount; Power Rating: 63mW; Case Code (Metric): 1005; Width: 0.02inch; Height: 0.35mm
R41 = CMP-RES-00008-4: 6.04 Ohms ±1% 0.063W, 1/16W Chip Resistor 0402 (1005 Metric); Max Power Dissipation: 63mW; Temperature Coefficient: 100ppm/°C; Voltage Rating: 50V; Weight: 2.3E-05oz; Package Quantity: 10; Power Rating: 63mW; Length: 1mm; Height: 0.016inch; Min Operating Temperature: -55°C; Military Standard: Not; Termination: SMD/SMT; Case/Package: 0402; Contact Plating: Tin; Depth: 0.5mm; Number of Terminations: 2; Features: Automotive AEC-Q200; Case Code (Metric): 1005; Composition: Thick Film; Max Operating Temperature: 155°C; Lead Free: Lead Free; Width: 0.02inch; Packaging: Tape and Reel; Case Code (Imperial): 0402; Tolerance: 1%
R62 = CMP-RES-00014-4: 0 Ohms Jumper 0.063W, 1/16W Chip Resistor 0402 (1005 Metric); Temperature Coefficient: 200ppm/°C; Power Rating: 62.5mW; Max Power Dissipation: 63mW; Tolerance: 5%; Voltage Rating: 50V; Lead Free: Lead Free; Height: 0.016inch; Military Standard: Not; Max Operating Temperature: 155°C; Features: Moisture Resistant; Case/Package: 0402; Contact Plating: Tin,Matte; Composition: Thick Film; Number of Terminations: 2; Case Code (Imperial): 0402; Package Quantity: 1; REACH SVHC: Unknown; Radiation Hardening: No; Case Code (Metric): 1005; Width: 0.02inch; Termination: SMD/SMT; Min Operating Temperature: -55°C; Length: 1mm; Packaging: Tape and Reel; Depth: 0.5mm
ST5 ST6 = CMP-MECH-00004-4: Pad, 2.54mm x 2.54mm
TP8 TP10-TP15 TP19 TP20 = CMP-MECH-00011-2: 0.8mm round; Pins: 1
U11 = CMP-PMIC-00002-5: Buck-Boost Switching Regulator IC Positive Adjustable 1.2V 1 Output 900mA (Switch) 10-WFDFN Exposed Pad; Min Supply Voltage: 1.8V; Quiescent Current: 25uA; Synchronous Rectifier: Yes; Max Output Current: 800mA; Max Output Voltage: 5.5V; Nominal Supply Current: 50uA; Switching Frequency: 2.4MHz; Efficiency: 96%; Number of Outputs: 1; Topology: Buck-Boost; ComponentLink1Description: Datasheet; ComponentLink1URL: http://www.ti.com/lit/ds/symlink/tps63030.pdf; Radiation Hardening: No; Max Operating Temperature: 85°C; Min Operating Temperature: -40°C; Package Quantity: 3000; REACH SVHC: No SVHC; Number of Pins: 10; Packaging: Tape and Reel; Case/Package: 10-SON (2.5x2.5); Output Type: Adjustable; Lead Free: Lead Free; Output Configuration: Positive; Output Current: 800mA; Mount: Surface Mount; Operating Supply Voltage: 5.5V; Contact Plating: Gold; Min Input Voltage: 1.8V; Max Input Voltage: 5.5V; Output Voltage: 5.5V; Min Output Voltage: 1.2V
U12 = CMP-PMIC-00012-5: Power Switch/Driver 1:1 P-Channel 400mA USP-8B06; Fault Protection: Short Circuit; Interface: On/Off; Number of Outputs: 1; Output Configuration: High Side; ComponentLink1Description: Datasheet; Packaging: Tape and Reel; Max Output Current: 400mA; Max Operating Temperature: 85°C; ComponentLink1URL: https://www.torexsemi.com/file/xc6192/XC6192.pdf; Min Operating Temperature: -40°C
U13 = CMP-PMIC-00004-1: Boost Switching Regulator IC Positive Adjustable 1.8V 1 Output 200mA (Switch) 6-TSSOP, SC-88, SOT-363; Efficiency: 95%; Switching Frequency: 2MHz; Output Voltage: 5.5V; Max Output Current: 500mA; Synchronous Rectifier: Yes; Number of Outputs: 1; Quiescent Current: 5uA; Min Input Voltage: 700mV; REACH SVHC: No SVHC; Min Operating Temperature: -40°C; Max Operating Temperature: 85°C; Packaging: Tape and Reel; ComponentLink1Description: Datasheet; Package Quantity: 1; Output Type: Adjustable; Min Output Voltage: 1.8V; Max Output Voltage: 5.5V; Operating Supply Voltage: 5.5V; Number of Pins: 6; Topology: Boost; ComponentLink1URL: http://www.ti.com/lit/ds/symlink/tps61220.pdf; Lead Free: Lead Free; Radiation Hardening: No; Output Current: 200mA; Max Input Voltage: 5.5V
U14 = CMP-IC-AMP-0000-7: General Purpose Amplifier 1 Circuit Rail-to-Rail SC-70-6; Slew Rate: 0.42V/µs; Output Current: 8mA; Output Current per Channel: 100mA; Number of Amplifiers: 1; Common Mode Rejection Ratio: 50dB; Operating Supply Current: 116uA; Unity Gain Bandwidth Product: 1.5MHz; Nominal Supply Current: 103uA; Bandwidth: 1.4MHz; Power Supply Rejection Ratio (PSRR): 75dB; Min Supply Voltage: 1.8V; Input Offset Voltage (Vos): 4mV; Max Supply Voltage: 5V; Operating Supply Voltage: 3V; Input Bias Current: 35nA; Voltage Gain: 113dB; ComponentLink1Description: Datasheet; Length: 2mm; Radiation Hardening: No; Width: 1.25mm; Min Operating Temperature: -40°C; Number of Circuits: 1; REACH SVHC: No SVHC; Contact Plating: Tin; Case/Package: SC; Number of Channels: 1; Package Quantity: 1000; Gain Bandwidth Product: 1.5MHz; Mount: Surface Mount; Height: 0.9mm; Weight: 0.01lb; Lead Free: Lead Free; ComponentLink1URL: http://www.ti.com/lit/ds/symlink/lmv981-n.pdf?ts=1588113028077; Number of Elements: 1; Packaging: Tape and Reel; Number of Pins: 6; Max Operating Temperature: 125°C
U15 = CMP-PMIC-00001-5: LED Driver IC 1 Output DC DC Regulator Step-Up (Boost) PWM Dimming 550mA 8-DFN (2x3); Output Voltage: 5V; Number of Outputs: 1; Nominal Input Voltage (DC): 500mV; Output Type: Adjustable; Output Current: 1.6A; Min Output Voltage: 600mV; Frequency: 1MHz; Weight: 0.001319oz; Package Quantity: 150; Case/Package: DFN; Max Operating Temperature: 85°C; Max Output Current: 550mA; Topology: Boost; Max Input Voltage: 5V; Number of Pins: 8; Min Operating Temperature: -40°C; Number of Channels: 1; Max Output Voltage: 5V; Max Supply Voltage: 5V; Switching Frequency: 1MHz; Mount: Surface Mount; Radiation Hardening: No; Output Current per Channel: 550mA; Min Input Voltage: 500mV; Dimming: PWM; Packaging: Rail/Tube; ComponentLink1Description: Datasheet; ComponentLink1URL: http://ww1.microchip.com/downloads/en/DeviceDoc/20005208A.pdf
U20 = CMP-PMIC-00034-1: Series Voltage Reference IC 2.5V ±0.1%  8-WDFN (2x2); Supply Voltage-Max (Vsup): 5.5V; Trim/Adjustable Output: No; Min Output Voltage: 2.4975V; Package Body Material: Plastic; Time @ Peak Reflow Temperature-Max (s): 30s; Temp Coef of Voltage-Max: 50ppm/°C; Max Output Voltage: 2.5025V; Supply Voltage-Min (Vsup): 2.7V; Number of Terminals/Pins: 8; Number of Functions: 1; Analog IC - Other Type: THREE TERMINAL VOLTAGE REFERENCE; ComponentLink1URL: https://ww1.microchip.com/downloads/en/DeviceDoc/20005474E.pdf; Min Operating Temperature: -40°C; ComponentLink1Description: Datasheet; Max Operating Temperature: 125°C; Package Code: HVSON; Terminal Finish: Tin; Height - Seated (Max): 0.8mm; Surface Mount: Yes; Width: 2mm; Package Style: SMALL OUTLINE, HEAT SINK/SLUG, VERY THIN PROFILEMeter; Nominal Output Voltage: 2.5V; JESD-30 Code: S-PDSO-N8; JESD-609 Code: e3; Length: 2mm; Terminal Position: DUAL; Terminal Pitch: 0.5mm; Peak Reflow Temperature (Cel): 260°C; Package Shape: Square; Temperature Grade: AUTOMOTIVE; Terminal Form: No Lead; Number of Outputs: 1

## Sheet Camera.SchDoc
size B; DocumentNumber: 4; SheetNumber: 4; SheetTotal: 7; ENG_APP_DATE: --/--/--; DSN_APP_DATE: --/--/--; CHK_APP_DATE: --/--/--
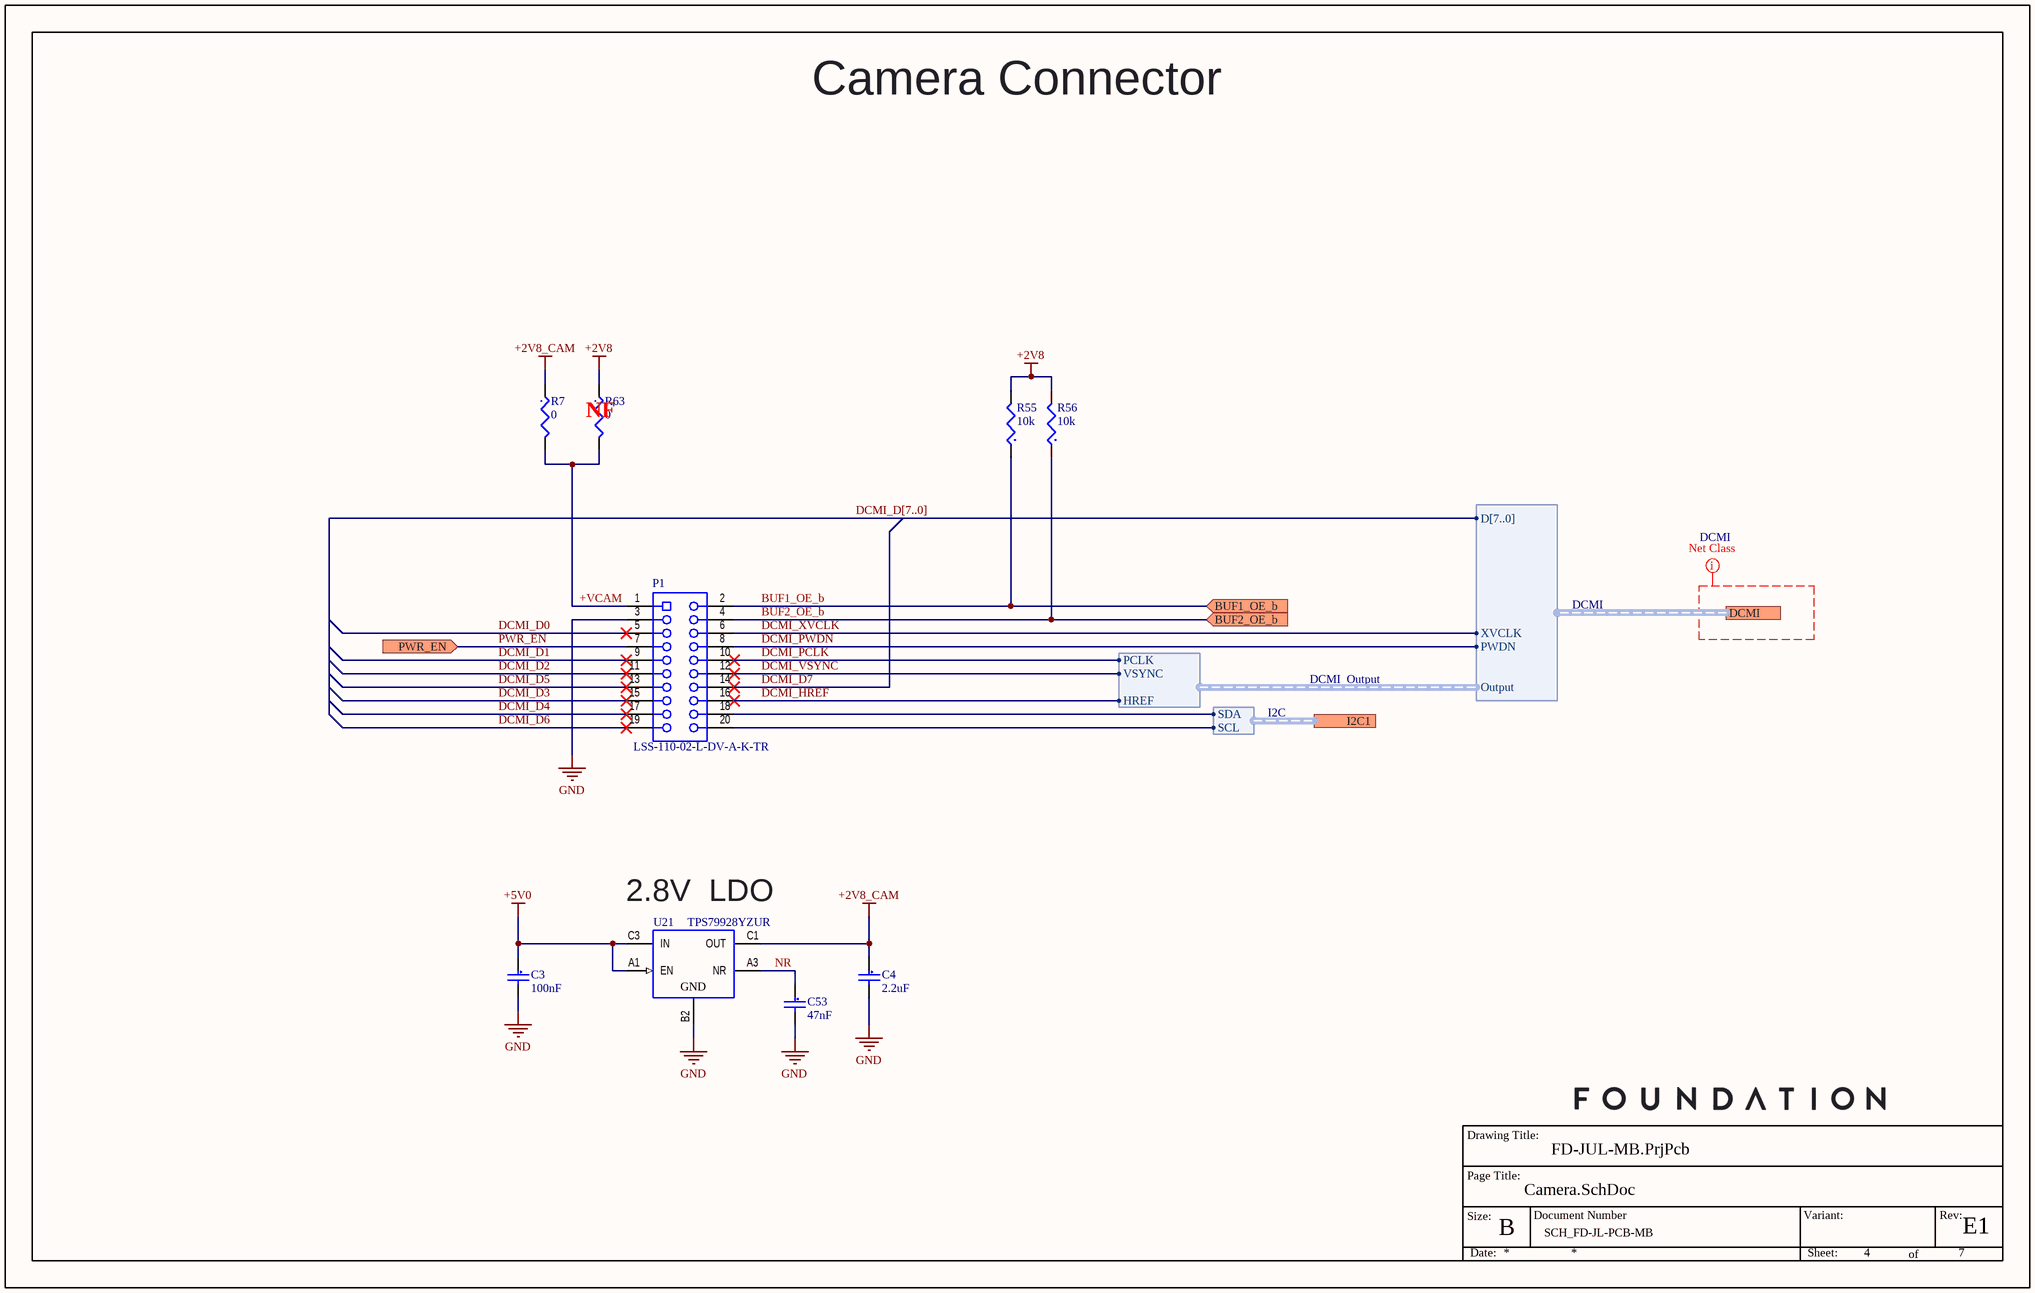
[diagram p5: Camera.SchDoc]

### Parts
C3  Capacitance: 100nF  [CAPC0402(1005)55_L]  (hidden comment: CAP CER 0.1uF 16V 10% X7R 0402)
C4  Capacitance: 2.2uF  [CAPC0402(1005)55_L]  (hidden comment: CAP CER 2.2uF 6.3V 10% X5R 0402)
C53  Capacitance: 47nF  [CAPC0402(1005)55_L]  (hidden comment: CAP CER 0.047uF 10V 10% X7R 0402)
P1  LSS-110-02-L-DV-A-K-TR  [SMTC - LSS-110-02-L-DV-A_V]
R7  Resistance: 0  [RESC0402(1005)_L]  (hidden comment: RES 0 OHM JUMPER 1/16W 0402)
R55  Resistance: 10k  [RESC0402(1005)_L]  (hidden comment: RES 10K 1/16W 1% 0402)
R56  Resistance: 10k  [RESC0402(1005)_L]  (hidden comment: RES 10K 1/16W 1% 0402)
R63  Resistance: 0  [RESC0402(1005)_L]  (hidden comment: RES 0 OHM JUMPER 1/16W 0402)
U21  TPS79928YZUR  [TI - DSBGA-YZU-5_V]

### Ports
BUF1_OE_b (in), BUF2_OE_b (in), DCMI (harness DCMI), I2C1 (harness I2C), PWR_EN (in)

### Harnesses
DCMI: Output, D[7..0], XVCLK, PWDN
DCMI_Output: HREF, PCLK, VSYNC
I2C: SCL, SDA

### Nets
+2V8: R55.2 R56.2 R63.1
+2V8_CAM: C4.1 R7.1 U21.C1(OUT)
+5V0: C3.1 U21.A1(EN) U21.C3(IN)
GND: C3.2 C4.2 C53.2 P1.3 U21.B2(GND)
+VCAM: P1.1 R7.2 R63.2
BUF1_OE_b: P1.2 R55.1 ; port BUF1_OE_b
BUF2_OE_b: P1.4 R56.1 ; port BUF2_OE_b
DCMI_D0: P1.5
DCMI_D1: P1.9
DCMI_D2: P1.11
DCMI_D3: P1.15
DCMI_D4: P1.17
DCMI_D5: P1.13
DCMI_D6: P1.19
DCMI_D7: P1.14
DCMI_HREF: P1.16 ; harness DCMI_Output.HREF
DCMI_PCLK: P1.10 ; harness DCMI_Output.PCLK
DCMI_PWDN: P1.8 ; port DCMI.PWDN
DCMI_VSYNC: P1.12 ; harness DCMI_Output.VSYNC
DCMI_XVCLK: P1.6 ; port DCMI.XVCLK
I2C1_SCL: P1.20 ; port I2C1.SCL
I2C1_SDA: P1.18 ; port I2C1.SDA
NR: C53.1 U21.A3(NR)
PWR_EN: P1.7 ; port PWR_EN

### Buses and harness runs
bus DCMI_D[7..0]

### Layout directives
net class DCMI: (no net found under the mark)

### Notes on the sheet
- Camera Connector
- (near U21) 2.8V  LDO
- Drawing Title:
- Page Title:
- Size:
- B
- Document Number
- Variant:
- Rev:
- Date:
- Sheet:
- of

### Library data of the parts
C3 = CMP-CAP-00002-2: as C14 on sheet Interface; Material: Ceramic; Tolerance: 10%; REACH SVHC: No SVHC; Radiation Hardening: No; Case Code (Metric): 1005; Height: 0.5mm; Depth: 0.5mm; Min Operating Temperature: -55°C; Max Operating Temperature: 125°C; Lead Free: Lead Free; Thickness: 0.022inch; Length: 1mm; Voltage Rating (DC): 16V; Dielectric Material: Ceramic; Packaging: Tape and Reel; Case/Package: 0402; Width: 0.5mm; Termination: SMD/SMT; Voltage Rating: 16V; Mount: Surface Mount; Case Code (Imperial): 0402; Package Quantity: 1; Dielectric: X7R; Number of Pins: 2; Voltage: 16V
C4 = CMP-CAP-00042-1: as C50 on sheet Power; Lead Free: Lead Free; Tolerance: 10%; Width: 0.02inch; Number of Pins: 2; Contact Plating: Tin,Matte; Max Operating Temperature: 85°C; Termination: SMD/SMT; Voltage Rating: 6.3V; Thickness: 0.022inch; Case Code (Imperial): 0402; Case Code (Metric): 1005; Radiation Hardening: No; Package Quantity: 1; Mount: Surface Mount; Length: 1mm; Case/Package: 0402; REACH SVHC: No SVHC; Packaging: Tape and Reel; Min Operating Temperature: -55°C; Dielectric: X5R; Depth: 0.5mm; Voltage Rating (DC): 6.3V
C53 = CMP-CAP-00056-1: 0.047µF ±10% 10V Ceramic Capacitor X7R 0402 (1005 Metric); Number of Terminals/Pins: 2; Multilayer: Yes; Height: 0.5mm; Package Shape: Rectangular; Positive Tolerance: 10%; Max Operating Temperature: 125°C; Termination: Wraparound; Capacitor Type: Ceramic; Width: 0.5mm; Negative Tolerance: 10%; Rated DC Voltage (URdc): 10V; Length: 1mm; Mount: Surface Mount; Size Code: 0402; JESD-609 Code: e3; Temperature Characteristics Code: X7R; Min Operating Temperature: -55°C; Terminal Finish: Nickel; Package Style: SMTMeter; Packaging: Tape and Reel; Dielectric Material: Ceramic
P1 = CMP-CON-0021-4: 20 Position Connector Self Mating, Non-Gendered Surface Mount Gold; Number of Contacts: 20; Pitch: 0.635mm; Termination: Solder; Radiation Hardening: No; Number of Rows: 2; Packaging: Bulk; Contact Plating: Gold
R7 R63 = CMP-RES-00014-4: as R62 on sheet Power; Lead Free: Lead Free; Height: 0.016inch; Military Standard: Not; Max Operating Temperature: 155°C; Features: Moisture Resistant; Case/Package: 0402; Contact Plating: Tin,Matte; Composition: Thick Film; Number of Terminations: 2; Case Code (Imperial): 0402; Package Quantity: 1; REACH SVHC: Unknown; Radiation Hardening: No; Case Code (Metric): 1005; Width: 0.02inch; Termination: SMD/SMT; Min Operating Temperature: -55°C; Length: 1mm; Packaging: Tape and Reel; Depth: 0.5mm
R55 R56 = CMP-RES-00006-3: as R16 on sheet Interface; Width: 0.02inch; Max Operating Temperature: 155°C; Case Code (Imperial): 0402; Mount: Surface Mount; Number of Terminations: 2; Military Standard: Not; Height: 0.35mm; Packaging: Tape and Reel; Lead Free: Lead Free; Case/Package: 0402; Composition: Thick Film; Weight: 2.3E-05oz; Radiation Hardening: No; Max Power Dissipation: 63mW; Contact Plating: Tin; Depth: 0.5mm; Package Quantity: 10; Tolerance: 1%; Length: 1mm; Min Operating Temperature: -55°C; REACH SVHC: Unknown; Voltage Rating: 50V; Case Code (Metric): 1005; Features: Automotive AEC-Q200; Termination: SMD/SMT; Number of Pins: 2
U21 = CMP-PMIC-00036-2: Linear Voltage Regulator IC  1 Output  200mA 5-DSBGA (1x1.37); Regulator Type: FIXED POSITIVE SINGLE OUTPUT LDO REGULATOR; Number of Outputs: 1; Input Voltage Absolute-Max: 7V; Voltage Tolerance-Max: 2%; Max Input Voltage: 6.5V; Dropout Voltage1-Max: 175mV; Dropout Voltage1-Nom: 100mV; Qualification Status: Not Qualified; Output Voltage1-Max: 2.856V; Number of Terminals/Pins: 5; Adjustability: FIXED; Output Voltage1-Min: 2.744V; Output Voltage1-Nom: 2.8V; Min Input Voltage: 2.975V; Package Code: VFBGA; Operating Temperature, TJ-Min: -40°C; Output Current1-Max: 200mA; Technology: BICMOS; Terminal Pitch: 0.5mm; Operating Temperature, TJ-Max: 125°C; Packaging: Tape and Reel; Surface Mount: Yes; Width: 1.195mm; Package Style: GRID ARRAY, VERY THIN PROFILE, FINE PITCHMeter; Terminal Position: BOTTOM; Terminal Form: Ball; Height - Seated (Max): 0.625mm; Terminal Finish: Copper; Package Shape: Rectangular; Moisture Sensitivity Level: 1; Number of Functions: 1; Length: 1.53mm; JESD-609 Code: e1; Peak Reflow Temperature (Cel): 260°C; ComponentLink1URL: https://www.ti.com/lit/ds/sbvs056k/sbvs056k.pdf; ComponentLink1Description: Datasheet